# EAGLE design module-mcu (EAGLE 7.4.0)
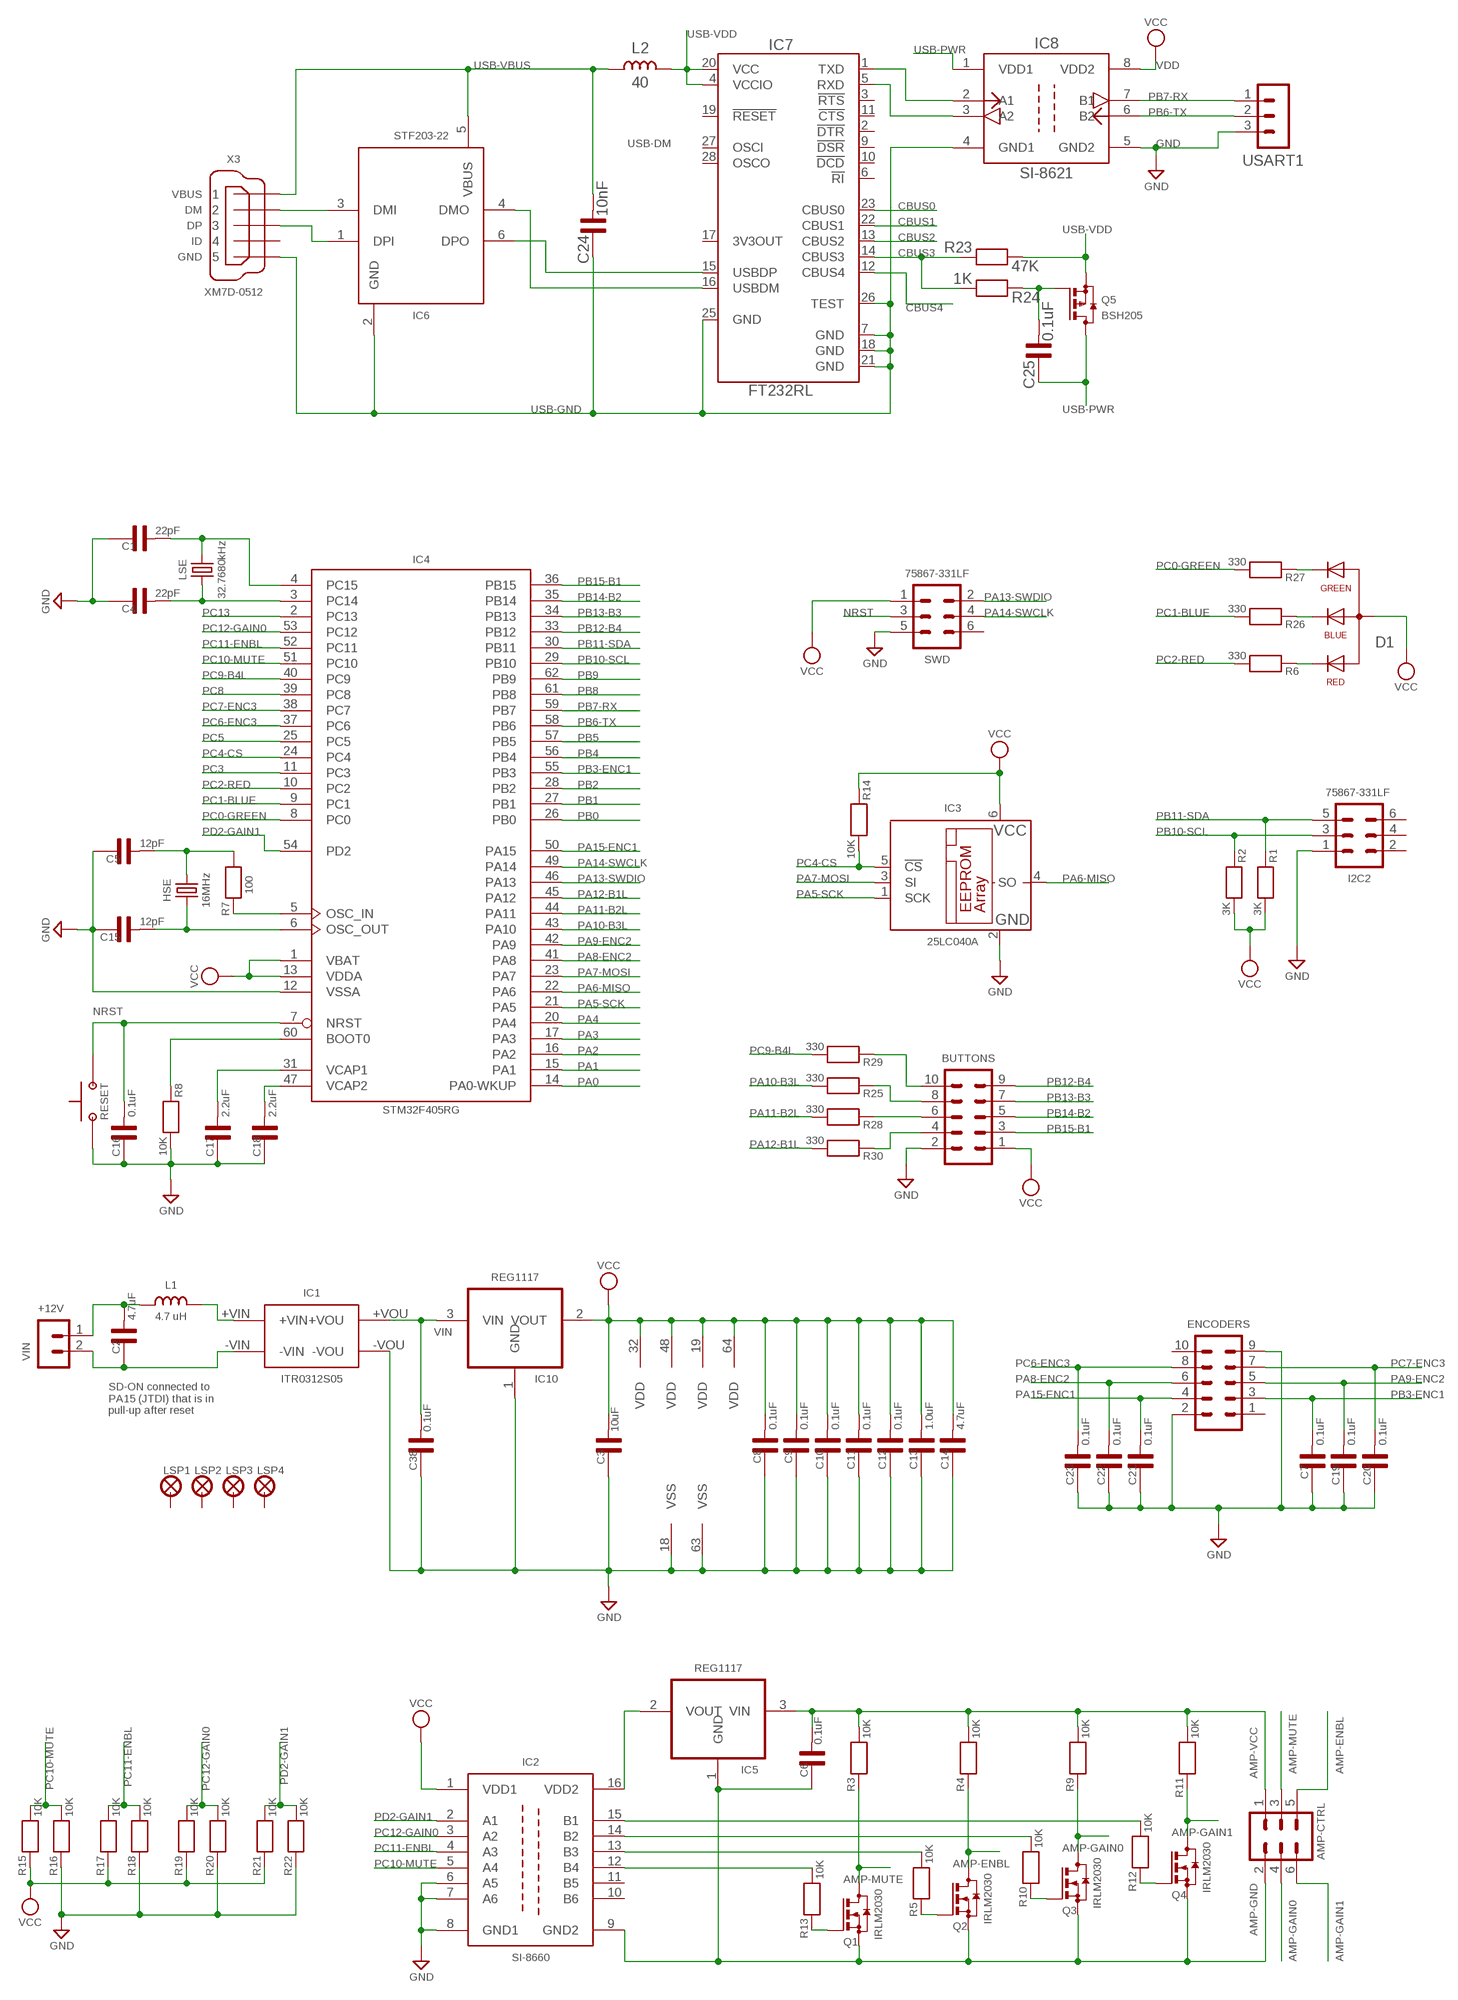
[diagram p0: schematic, sheet 1]

## Parts
AMP-CTRL  MA03-2PL  [MA03-2]
BUTTONS  MA05-2  [MA05-2]
C1  22pF  C-US0805  [C0805]
C2  4.7uF  C-US1206  [C1206]
C3  10uF  C-US0805  [C0805]
C4  22pF  C-US0805  [C0805]
C5  12pF  C-US0805  [C0805]
C6  0.1uF  C-US0805  [C0805]
C7  0.1uF  C-US0805  [C0805]
C8  0.1uF  C-US0805  [C0805]
C9  0.1uF  C-US0805  [C0805]
C10  0.1uF  C-US0805  [C0805]
C11  0.1uF  C-US0805  [C0805]
C12  0.1uF  C-US0805  [C0805]
C13  1.0uF  C-US0805  [C0805]
C14  4.7uF  C-US0805  [C0805]
C15  12pF  C-US0805  [C0805]
C16  0.1uF  C-US0805  [C0805]
C17  2.2uF  C-US0805  [C0805]
C18  2.2uF  C-US0805  [C0805]
C19  0.1uF  C-US0805  [C0805]
C20  0.1uF  C-US0805  [C0805]
C21  0.1uF  C-US0805  [C0805]
C22  0.1uF  C-US0805  [C0805]
C23  0.1uF  C-US0805  [C0805]
C24  10nF  C-US0805  [C0805]
C25  0.1uF  C-US0805  [C0805]
C38  0.1uF  C-US0805  [C0805]
D1  RGB-LED3X1MM  [RGB-LED-SMD-3X1]
ENCODERS  MA05-2  [MA05-2]
HSE  16MHz  Q-HSEHC-46X  [Q-HC-46X]
I2C2  75867-331LF  MA03-2PL  [MA03-2]
IC1  ITR0312S05  [ITR0312S05]
IC2  SI-8660  [SO16]
IC3  25LC040A  [SOT23-6]
IC4  STM32F405RG  STM32F405RGT  [LQFP64]
IC5  REG1117  [SOT223]
IC6  STF203-22  [SC70-6]
IC7  FT232RL  [SSOP28]
IC8  SI-8621  [SOIC-8]
IC10  REG1117  [SOT223]
L1  4.7 uH  L-USL0805  [L0805]
L2  40  L-USL0805  [L0805]
LSE  32.7680kHz  Q-LSECM7V-T1A  [Q-CM7V-T1A]
LSP1  LSP27  [LSP27]
LSP2  LSP27  [LSP27]
LSP3  LSP27  [LSP27]
LSP4  LSP27  [LSP27]
Q1  IRLM2030  BSS123  [SOT23]
Q2  IRLM2030  BSS123  [SOT23]
Q3  IRLM2030  BSS123  [SOT23]
Q4  IRLM2030  BSS123  [SOT23]
Q5  BSH205  BSH205G2R  [SOT23]
R1  3K  R-US0805  [R0805]
R2  3K  R-US0805  [R0805]
R3  10K  R-US0805  [R0805]
R4  10K  R-US0805  [R0805]
R5  10K  R-US0805  [R0805]
R6  330  R-US0805  [R0805]
R7  100  R-US0805  [R0805]
R8  10K  R-US0805  [R0805]
R9  10K  R-US0805  [R0805]
R10  10K  R-US0805  [R0805]
R11  10K  R-US0805  [R0805]
R12  10K  R-US0805  [R0805]
R13  10K  R-US0805  [R0805]
R14  10K  R-US0805  [R0805]
R15  10K  R-US0805  [R0805]
R16  10K  R-US0805  [R0805]
R17  10K  R-US0805  [R0805]
R18  10K  R-US0805  [R0805]
R19  10K  R-US0805  [R0805]
R20  10K  R-US0805  [R0805]
R21  10K  R-US0805  [R0805]
R22  10K  R-US0805  [R0805]
R23  47K  R-US0805  [R0805]
R24  1K  R-US0805  [R0805]
R25  330  R-US0805  [R0805]
R26  330  R-US0805  [R0805]
R27  330  R-US0805  [R0805]
R28  330  R-US0805  [R0805]
R29  330  R-US0805  [R0805]
R30  330  R-US0805  [R0805]
RESET  BUTTON-FSM14JRT  [BUTTON-FSM14JRT]
SWD  75867-331LF  MA03-2BLUE  [MA03-2-BLUE]
USART1  MA03-1PL  [MA03-1]
VIN  MA02-1GREEN  [MA02-1-GREEN]
X3  XM7D-0512  MINI-USB-5-DPI  [XM7D-0512]

## Nets
AMP-ENBL: AMP-CTRL.5 Q2.3(D) R4.1
AMP-GAIN0: AMP-CTRL.4 Q3.3(D) R9.1
AMP-GAIN1: AMP-CTRL.6 Q4.3(D) R11.1
AMP-GND: AMP-CTRL.2 C6.1 IC2.9(GND2) IC5.1(GND) Q1.2(S) Q2.2(S) Q3.2(S) Q4.2(S)
AMP-MUTE: AMP-CTRL.3 Q1.3(D) R3.1
AMP-VCC: AMP-CTRL.1 C6.2 IC5.3(VIN) R3.2 R4.2 R9.2 R11.2
BOOT: IC4.60(BOOT0) R8.1
CBUS0: IC7.23(CBUS0)
CBUS1: IC7.22(CBUS1)
CBUS2: IC7.13(CBUS2)
CBUS3: IC7.14(CBUS3) R23.1 R24.2
CBUS4: IC7.12(CBUS4)
GND: BUTTONS.2 C1.1 C3.1 C4.1 C5.1 C7.1 C8.1 C9.1 C10.1 C11.1 C12.1 C13.1 C14.1 C15.1 C16.1 C17.1 C18.1 C19.1 C20.1 C21.1 C22.1 C23.1 C38.1 ENCODERS.2 ENCODERS.9 I2C2.1 IC1.-VOU IC2.6(A5) IC2.7(A6) IC2.8(GND1) IC3.2(GND) IC4.12(VSSA) IC4.18(VSS) IC4.63(VSS) IC8.5(GND2) IC10.1(GND) R8.2 R16.1 R18.1 R20.1 R22.1 RESET.P$1 SWD.5 USART1.3
N$4: C2.1 IC1.-VIN VIN.2
N$5: D1.P$1(AR) R6.1
N$6: IC4.5(OSC_IN) R7.1
N$10: IC1.+VIN L1.2
N$11: C2.2 L1.1 VIN.1
N$13: Q2.1(G) R5.1
N$17: Q1.1(G) R13.1
N$22: IC2.12(B4) R13.2
N$24: IC2.13(B3) R5.2
N$26: Q3.1(G) R10.1
N$27: IC2.14(B2) R10.2
N$29: Q4.1(G) R12.1
N$36: IC2.15(B1) R12.2
N$37: IC2.16(VDD2) IC5.2(VOUT)
N$38: IC6.1(DPI) X3.3
N$40: D1.P$4(AB) R26.1
N$42: IC6.3(DMI) X3.2
N$43: IC7.1(TXD) IC8.2(A1)
N$44: IC7.5(RXD) IC8.3(A2)
N$46: C25.2 Q5.1(G) R24.1
N$47: BUTTONS.4 R30.1
N$64: BUTTONS.6 R28.1
N$65: BUTTONS.8 R25.1
N$69: BUTTONS.10 R29.1
N$71: C5.2 HSE.1 R7.2
N$75: D1.P$3(AG) R27.1
N$78: C15.2 HSE.2 IC4.6(OSC_OUT)
NRST: C16.2 IC4.7(NRST) RESET.P$2 SWD.3
PA0: IC4.14(PA0-WKUP)
PA1: IC4.15(PA1)
PA2: IC4.16(PA2)
PA3: IC4.17(PA3)
PA4: IC4.20(PA4)
PA5-SCK: IC3.1(SCK) IC4.21(PA5)
PA6-MISO: IC3.4(SO) IC4.22(PA6)
PA7-MOSI: IC3.3(SI) IC4.23(PA7)
PA8-ENC2: C22.2 ENCODERS.6 IC4.41(PA8)
PA9-ENC2: C19.2 ENCODERS.5 IC4.42(PA9)
PA10-B3L: IC4.43(PA10) R25.2
PA11-B2L: IC4.44(PA11) R28.2
PA12-B1L: IC4.45(PA12) R30.2
PA13-SWDIO: IC4.46(PA13) SWD.2
PA14-SWCLK: IC4.49(PA14) SWD.4
PA15-ENC1: C21.2 ENCODERS.4 IC4.50(PA15)
PB0: IC4.26(PB0)
PB1: IC4.27(PB1)
PB2: IC4.28(PB2)
PB3-ENC1: C7.2 ENCODERS.3 IC4.55(PB3)
PB4: IC4.56(PB4)
PB5: IC4.57(PB5)
PB6-TX: IC4.58(PB6) IC8.6(B2) USART1.2
PB7-RX: IC4.59(PB7) IC8.7(B1) USART1.1
PB8: IC4.61(PB8)
PB9: IC4.62(PB9)
PB10-SCL: I2C2.3 IC4.29(PB10) R2.1
PB11-SDA: I2C2.5 IC4.30(PB11) R1.1
PB12-B4: BUTTONS.9 IC4.33(PB12)
PB13-B3: BUTTONS.7 IC4.34(PB13)
PB14-B2: BUTTONS.5 IC4.35(PB14)
PB15-B1: BUTTONS.3 IC4.36(PB15)
PC0-GREEN: IC4.8(PC0) R27.2
PC1-BLUE: IC4.9(PC1) R26.2
PC2-RED: IC4.10(PC2) R6.2
PC3: IC4.11(PC3)
PC4-CS: IC3.5(!CS) IC4.24(PC4) R14.2
PC5: IC4.25(PC5)
PC6-ENC3: C23.2 ENCODERS.8 IC4.37(PC6)
PC7-ENC3: C20.2 ENCODERS.7 IC4.38(PC7)
PC8: IC4.39(PC8)
PC9-B4L: IC4.40(PC9) R29.2
PC10-MUTE: IC2.5(A4) IC4.51(PC10) R15.2 R16.2
PC11-ENBL: IC2.4(A3) IC4.52(PC11) R17.2 R18.2
PC12-GAIN0: IC2.3(A2) IC4.53(PC12) R19.2 R20.2
PC13: IC4.2(PC13)
PD2-GAIN1: IC2.2(A1) IC4.54(PD2) R21.2 R22.2
Q2M: C4.2 IC4.3(PC14) LSE.1
Q2P: C1.2 IC4.4(PC15) LSE.2
USB-DM: IC6.4(DMO) IC7.16(USBDM)
USB-DP: IC6.6(DPO) IC7.15(USBDP)
USB-GND: C24.1 IC6.2(GND) IC7.7(GND) IC7.18(GND) IC7.21(GND) IC7.25(GND) IC7.26(TEST) IC8.4(GND1) X3.5
USB-PWR: C25.1 IC8.1(VDD1) Q5.3(D)
USB-VBUS: C24.2 IC6.5(VBUS) L2.1 X3.1
USB-VDD: IC7.4(VCCIO) IC7.20(VCC) L2.2 Q5.2(S) R23.2
VCAP3: C18.2 IC4.47(VCAP2)
VCAP4: C17.2 IC4.31(VCAP1)
VDD: BUTTONS.1 C3.2 C8.2 C9.2 C10.2 C11.2 C12.2 C13.2 C14.2 D1.P$2(C) IC2.1(VDD1) IC3.6(VCC) IC4.1(VBAT) IC4.13(VDDA) IC4.19(VDD) IC4.32(VDD) IC4.48(VDD) IC4.64(VDD) IC8.8(VDD2) IC10.2(VOUT) R1.2 R2.2 R14.1 R15.1 R17.1 R19.1 R21.1 SWD.1 ; supply symbol labelled VCC
VIN: C38.2 IC1.+VOU IC10.3(VIN)
Unconnected: ENCODERS.1 ENCODERS.10 I2C2.2 I2C2.4 I2C2.6 IC2.10(B6) IC2.11(B5) IC7.2(!DTR) IC7.3(!RTS) IC7.6(!RI) IC7.9(!DSR) IC7.10(!DCD) IC7.11(!CTS) IC7.17(3V3OUT) IC7.19(!RESET) IC7.27(OSCI) IC7.28(OSCO) LSP1.MP LSP2.MP LSP3.MP LSP4.MP SWD.6 X3.4 X3.M1(S1) X3.M2(S2) X3.M3(S3) X3.M4(S4)

## Notes on the sheet
- SD-ON connected to 
  PA15 (JTDI) that is in 
  pull-up after reset

## Library data of the parts
AMP-CTRL I2C2 SWD = MyComponents:MA03-2: Headers & Wire Housing, 2 Row, 6 Position
BUTTONS ENCODERS = MyComponents:MA05-2: Headers & Wire Housing, 2 Row, 10 Position
C1 C3-C25 C38 = MyComponents:C-US: SMD Multilayer Ceramic Capacitor; MOUSER: 80-C0805C104J5RAUTO
C2 = MyComponents:C-US: SMD Multilayer Ceramic Capacitor
D1 = MyComponents:RGB-LED: T-1 3/4 (5mm) full color LED lamp; MOUSER: 604-APFA3010LSEEZGKQ
HSE = MyComponents:Q-HSE: HSE SMD Crystal; MOUSER: 520-160-20-46X
IC1 = MyComponents:ITR0312S05: ITR03 Series DC-DC Converter; MOUSER: 490-ITR0312S05
IC2 = MyComponents:SI-8660: Ultra-low-power digital isolator (6 channels)
IC3 = MyComponents:25LC040A: 4K SPI Bus Serial EEPROM; MOUSER: 579-25LC040AT-E/OT
IC4 = stm32:STM32F405R*T: ARM 32-bit Cortex™-M3 CPU 168 MHz maximum frequency 1024 Kbytes of Flash memory 192 kbytes of SRAM 51 GPIOs 1.8 to 3.6 V application supply; MOUSER: 511-STM32F405RGT6
IC5 IC10 = MyComponents:REG1117: 800mA and 1A Low Dropout (LDO) Positive Regulator 1.8V, 2.5V, 2.85V, 3.3V, 5V, and Adj; MOUSER: 511-LD1117S33
IC6 = MyComponents:STF203: USB EMI filtering and ESD protection; MOUSER: 947-STF203-22.TCT
IC7 = ftdichip:FT232R: Source: http://www.ftdichip.com/Documents/DataSheets/DS_FT232R_v104.pdf; MOUSER: 895-FT232RL
IC8 = MyComponents:SI-8621: Two channel ultra-low-power digital isolator; MOUSER: 634-SI8621AB-B-IS
L1 L2 = MyComponents:L-US: SMD Ferrite Bead; MOUSER: 963-CKP2012N1R0M-T
LSE = MyComponents:Q-LSE: 32.768 kHz SMD Crystal; MOUSER: 428-201562-MG01
LSP1-LSP4 = MyComponents:LSP27: Solder Pad, drill 2.75 mm
Q1-Q4 = transistor-small-signal:BSS123: N-CHANNEL MOS FET
Q5 = MyComponents:BSH205G2R: P-channel enhancement mode MOSFET (-2.3A); MOUSER: 771-BSH205G2R
R1-R30 = MyComponents:R-US: SMD Resistor; MOUSER: 660-RK73H2ATTDD1R00F
RESET = MyComponents:BUTTON-FSM14JRT: TE Connectivity / Alcoswitch Round Switch; MOUSER: 506-1571010-1
USART1 = MyComponents:MA03-1: Headers & Wire Housing, 1 Row, 3 Position
VIN = MyComponents:MA02-1: Headers & Wire Housing, 1 Row, 3 Position
X3 = MyComponents:MINI-USB-5-DPI: Mini USB Type B Connector; MOUSER: 653-XM7D-0512

## Board
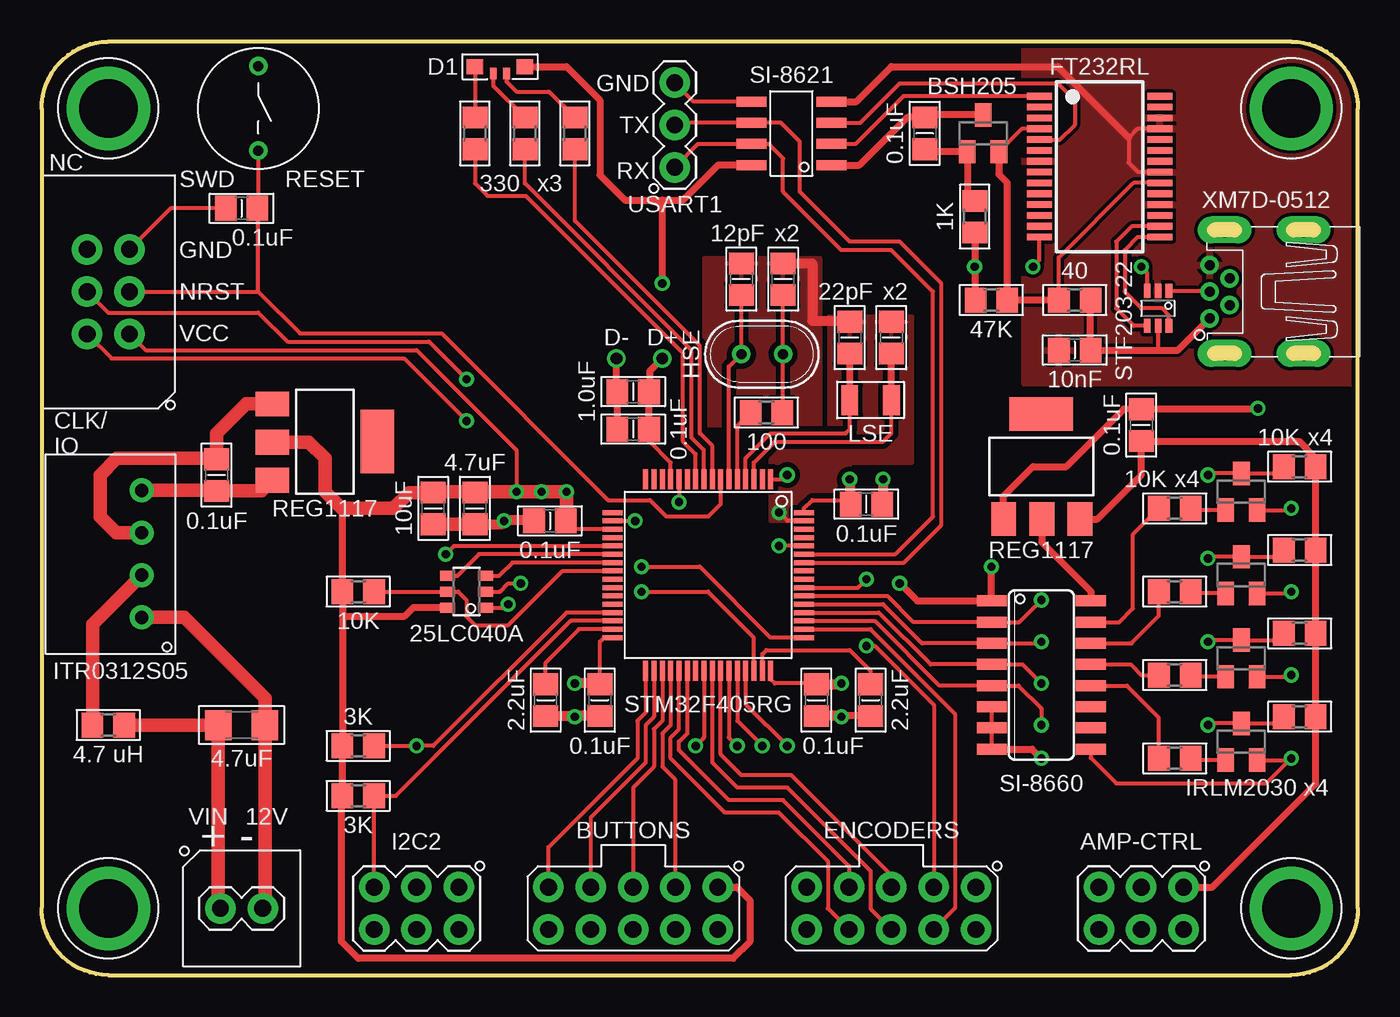
[diagram p1: board, top side]
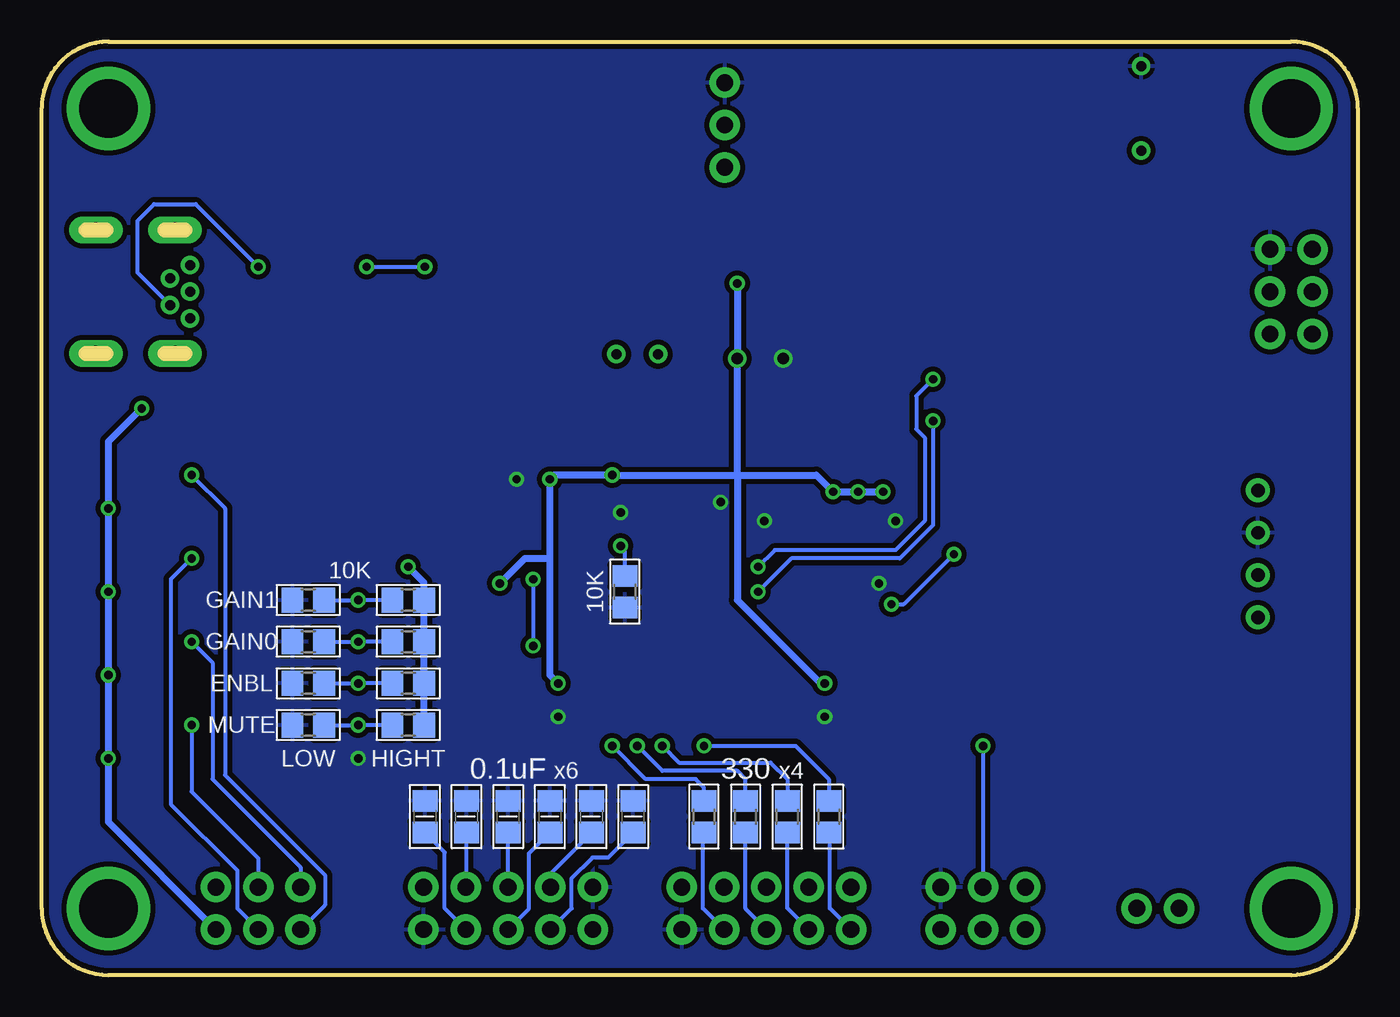
[diagram p2: board, bottom side, seen from below]

Size 79 x 56 mm. Coordinates in mm from the lower left corner, seen from the top.
Outline: 79,4 79,52 arc90 75,56 4,56 arc90 0,52 0,4 arc90 4,0 75,0 arc90 79,4
Copper layers (1*16): Top 0.035mm / dielectric 1.5mm / Bottom 0.035mm
Design rules "eagle *": minimum track width 10mil, minimum drill 19mil, track to track 8mil, track to pad 8mil, pad to pad 7mil, via to via 12mil, smd to smd 7mil, copper to edge 10mil, drill to drill 30mil, minimum pad ring 10mil, minimum via ring 8mil, stop-mask expansion 4mil, vias tented up to drill 0mil, thermal gap 10mil

### Footprints (pad centres in the part's own frame; a part is rotated, then mirrored left to right if it is on the bottom)
MA03-2 = drill 1.016: 1 -2.54,-1.27; 2 -2.54,1.27; 3 0,-1.27; 4 0,1.27; 5 2.54,-1.27; 6 2.54,1.27
MA05-2 = drill 1.016: 1 -5.08,-1.27; 2 -5.08,1.27; 3 -2.54,-1.27; 4 -2.54,1.27; 5 0,-1.27; 6 0,1.27; 7 2.54,-1.27; 8 2.54,1.27; 9 5.08,-1.27; 10 5.08,1.27
C0805 = smd 1.3 x 1.5: 1 -0.95,0; 2 0.95,0
C1206 = smd 1.6 x 1.8: 1 -1.4,0; 2 1.4,0
RGB-LED-SMD-3X1 = smd 1 x 0.9: P$1 1.5,0; P$2 -1.5,0 | smd 0.4 x 0.68: P$3 -0.4,0.4; P$4 0.4,0.4
Q-HC-46X = drill 0.61: 1 -1.25,0; 2 1.25,0
ITR0312S05 = drill 0.8: +VIN 0,0; +VOU 5.08,0; -VIN -2.54,0; -VOU 2.54,0
SO16 = smd 0.66 x 1.8: 1 -4.445,-2.973; 2 -3.175,-2.973; 3 -1.905,-2.973; 4 -0.635,-2.973; 5 0.635,-2.973; 6 1.905,-2.973; 7 3.175,-2.973; 8 4.445,-2.973; 9 4.445,2.973; 10 3.175,2.973; 11 1.905,2.973; 12 0.635,2.973; 13 -0.635,2.973; 14 -1.905,2.973; 15 -3.175,2.973; 16 -4.445,2.973
SOT23-6 = smd 0.6 x 0.9: 1 -0.95,-1.15; 2 0,-1.15; 3 0.95,-1.15; 4 0.95,1.15; 5 0,1.15; 6 -0.95,1.15
LQFP64 = smd 0.3 x 1.2: 1 -3.75,-5.75; 2 -3.25,-5.75; 3 -2.75,-5.75; 4 -2.25,-5.75; 5 -1.75,-5.75; 6 -1.25,-5.75; 7 -0.75,-5.75; 8 -0.25,-5.75; 9 0.25,-5.75; 10 0.75,-5.75; 11 1.25,-5.75; 12 1.75,-5.75; 13 2.25,-5.75; 14 2.75,-5.75; 15 3.25,-5.75; 16 3.75,-5.75; 33 3.75,5.75; 34 3.25,5.75; 35 2.75,5.75; 36 2.25,5.75; 37 1.75,5.75; 38 1.25,5.75; 39 0.75,5.75; 40 0.25,5.75; 41 -0.25,5.75; 42 -0.75,5.75; 43 -1.25,5.75; 44 -1.75,5.75; 45 -2.25,5.75; 46 -2.75,5.75; 47 -3.25,5.75; 48 -3.75,5.75 | smd 1.2 x 0.3: 17 5.75,-3.75; 18 5.75,-3.25; 19 5.75,-2.75; 20 5.75,-2.25; 21 5.75,-1.75; 22 5.75,-1.25; 23 5.75,-0.75; 24 5.75,-0.25; 25 5.75,0.25; 26 5.75,0.75; 27 5.75,1.25; 28 5.75,1.75; 29 5.75,2.25; 30 5.75,2.75; 31 5.75,3.25; 32 5.75,3.75; 49 -5.75,3.75; 50 -5.75,3.25; 51 -5.75,2.75; 52 -5.75,2.25; 53 -5.75,1.75; 54 -5.75,1.25; 55 -5.75,0.75; 56 -5.75,0.25; 57 -5.75,-0.25; 58 -5.75,-0.75; 59 -5.75,-1.25; 60 -5.75,-1.75; 61 -5.75,-2.25; 62 -5.75,-2.75; 63 -5.75,-3.25; 64 -5.75,-3.75
SOT223 = smd 1.499 x 2.007: 1 -2.261,-3.15; 2 0.025,-3.15; 3 2.311,-3.15 | smd 3.81 x 2.007: 4 0,3.15
SC70-6 = smd 0.4 x 0.85: 1 -0.65,-1.05; 2 0,-1.05; 3 0.65,-1.05; 4 0.65,1.05; 5 0,1.05; 6 -0.65,1.05
SSOP28 = smd 0.4 x 1.5: 1 -4.225,-3.625; 2 -3.575,-3.625; 3 -2.925,-3.625; 4 -2.275,-3.625; 5 -1.625,-3.625; 6 -0.975,-3.625; 7 -0.325,-3.625; 8 0.325,-3.625; 9 0.975,-3.625; 10 1.625,-3.625; 11 2.275,-3.625; 12 2.925,-3.625; 13 3.575,-3.625; 14 4.225,-3.625; 15 4.225,3.625; 16 3.575,3.625; 17 2.925,3.625; 18 2.275,3.625; 19 1.625,3.625; 20 0.975,3.625; 21 0.325,3.625; 22 -0.325,3.625; 23 -0.975,3.625; 24 -1.625,3.625; 25 -2.275,3.625; 26 -2.925,3.625; 27 -3.575,3.625; 28 -4.225,3.625
SOIC-8 = smd 0.6 x 1.8: 1 -1.905,-2.4; 2 -0.635,-2.4; 3 0.635,-2.4; 4 1.905,-2.4; 5 1.905,2.4; 6 0.635,2.4; 7 -0.635,2.4; 8 -1.905,2.4
L0805 = smd 1.3 x 1.5: 1 -0.95,0; 2 0.95,0
Q-CM7V-T1A = smd 1 x 1.8: 1 -1.25,0; 2 1.25,0
LSP27 = drill 3.5 pad 5: MP 0,0
SOT23 = smd 1 x 1.4: 1 -0.95,-1.1; 2 0.95,-1.1; 3 0,1.1
R0805 = smd 1.3 x 1.5: 1 -0.95,0; 2 0.95,0
BUTTON-FSM14JRT = drill 0.6: P$1 -2.54,0; P$2 2.54,0
MA03-2-BLUE = drill 1.016: 1 -2.54,-1.27; 2 -2.54,1.27; 3 0,-1.27; 4 0,1.27; 5 2.54,-1.27; 6 2.54,1.27
MA03-1 = drill 1.016: 1 -2.54,0; 2 0,0; 3 2.54,0
MA02-1-GREEN = drill 1.016: 1 -1.27,0; 2 1.27,0
XM7D-0512 = drill 0.6 pad 1.016: 1 1.6,-0.9; 2 0.8,0.3; 3 0,-0.9; 4 -0.8,0.3; 5 -1.6,-0.9 | drill 0.9 pad 1.422 long: M1 3.7,4.75; M2 -3.7,4.75; M3 -3.7,0; M4 3.7,0

### Placement (x,y rotation side)
AMP-CTRL  66,4 180 top
BUTTONS  35.5,4 180 top
C1  48.5,38.25 270 top
C2  12,15 180 top
C3  23.5,28 90 top
C4  51,38.25 270 top
C5  44.5,41.75 270 top
C6  66,33 270 top
C7  53.5,9.5 270 bottom
C8  46.5,16.5 90 top
C9  33.5,16.5 90 top
C10  35.5,32.75 0 top
C11  30.5,27.25 0 top
C12  49.5,28.25 180 top
C13  35.5,35 0 top
C14  26,28 90 top
C15  42,41.75 270 top
C16  12,46 0 top
C17  30.25,16.5 90 top
C18  49.75,16.5 90 top
C19  51,9.5 270 bottom
C20  46,9.5 270 bottom
C21  56,9.5 270 bottom
C22  48.5,9.5 270 bottom
C23  43.5,9.5 270 bottom
C24  62,37.5 0 top
C25  53,50.5 270 top
C38  10.5,30 270 top
D1  27.5,54.5 180 top
ENCODERS  51,4 180 top
HSE  43.25,37.25 180 top
I2C2  22.5,4 180 top
IC1  6,24 90 top
IC2  60,18 270 top
IC3  25.5,23 90 top
IC4  40,24 180 top
IC5  60,30.5 0 top
IC6  67,40 180 top
IC7  63.5,48.5 270 top
IC8  45,50.5 90 top
IC10  17,32 270 top
L1  4,15 180 top
L2  62,40.5 180 top
LSE  49.75,34.5 180 top
LSP1  75,4 90 top
LSP2  75,52 90 top
LSP3  4,4 90 top
LSP4  4,52 90 top
Q1  72,14 0 top
Q2  72,19 0 top
Q3  72,24 0 top
Q4  72,29 0 top
Q5  56.5,50.5 0 top
R1  19,10.75 180 top
R2  19,13.75 180 top
R3  75.5,15.5 0 top
R4  75.5,20.5 0 top
R5  68,18 180 top
R6  26,50.5 270 top
R7  43.5,33.75 0 top
R8  44,23 270 bottom
R9  75.5,25.5 0 top
R10  68,23 180 top
R11  75.5,30.5 0 top
R12  68,28 180 top
R13  68,13 180 top
R14  19,23 0 top
R15  57,15 180 bottom
R16  63,15 0 bottom
R17  57,17.5 180 bottom
R18  63,17.5 0 bottom
R19  57,20 180 bottom
R20  63,20 0 bottom
R21  57,22.5 180 bottom
R22  63,22.5 0 bottom
R23  57,40.5 0 top
R24  56,45.5 270 top
R25  34.25,9.5 90 bottom
R26  29,50.5 270 top
R27  32,50.5 270 top
R28  36.75,9.5 90 bottom
R29  31.75,9.5 90 bottom
R30  39.25,9.5 90 bottom
RESET  13,52 270 top
SWD  4,41 90 top
USART1  38,51 90 top
VIN  12,4 0 top
X3  71,41 270 top

### Tracks (layer width: path | path; a pad name or v marks a point on that pad's centre or on a via)
AMP-ENBL  (via drill 0.5)
  Top 0.254: v70,20 70.1,20.1 Q2.3 74.55,20.1 R4.1
  Bottom 0.254: v70,20 68.75,18.75 68.75,11.75 63.46,6.46 AMP-CTRL.5
AMP-GAIN0  (via drill 0.5)
  Top 0.254: v70,25 70.1,25.1 Q3.3 74.55,25.1 R9.1
  Bottom 0.254: v70,25 71.25,23.75 71.25,10.25 67.25,6.25 67.25,3.98 AMP-CTRL.4
AMP-GAIN1  (via drill 0.5)
  Top 0.254: v70,30 70.1,30.1 Q4.3 74.55,30.1 R11.1
  Bottom 0.254: v70,30 68,28 68,12 62,6 62,4.19 AMP-CTRL.6
AMP-GND  (via drill 0.5)
  Top 0.254: Q1.2 74.9,12.9 v75,13 73.5,11.5 64.5,11.5 62.97,13.03 IC2.9 | Q2.2 74.9,17.9 v75,18 | Q3.2 74.9,22.9 v75,23 | Q4.2 74.9,27.9 v75,28 | v73,34 72.95,33.95
  Top 0.406: 72.95,33.95 C6.1 64.95,33.95 61.5,30.5 59.5,30.5 57.74,28.74 IC5.1
  Bottom 0.406: AMP-CTRL.2 75,9.19 v75,13 v75,18 v75,23 v75,28 75,32 v73,34
AMP-MUTE  (via drill 0.5)
  Top 0.254: v70,15 70.1,15.1 Q1.3 74.55,15.1 R3.1
  Bottom 0.254: v70,15 70,11 66,7 AMP-CTRL.3
AMP-VCC
  Top 0.254: R11.2 76.45,31.05 | 66.05,32 C6.2
  Top 0.406: R11.2 R9.2 R4.2 R3.2 76.45,11.45 70.27,5.27 AMP-CTRL.1 | 76.45,31.05 75.5,32 66.05,32 | IC5.3 63.35,27.35 66,30 C6.2
BOOT  (via drill 0.5)
  Top 0.254: IC4.60 v44.25,25.75
  Bottom 0.254: R8.1 44,25.5 v44.25,25.75
CBUS3  (via drill 0.5)
  Top 0.254: IC7.14 59.88,42.88 v59.5,42.5
  Top 0.406: R23.1 56.05,42.45 v56,42.5 R24.2
  Bottom 0.254: v59.5,42.5 v56,42.5
GND  (via drill 0.5, 0.7)
  Top 0.254: IC4.18 v35.62,27.25 | IC4.12 v38.25,28.38 | IC4.63 44.75,27.25 v44.25,27.75 | C16.1 7.73,46 SWD.5 | IC3.2 27.5,23 28,23.5 v28.75,23.5 | IC2.6 IC2.7 IC2.8 | IC8.5 39.13,52.41 USART1.3
  Top 0.406: 48,15.55 v48,15.5 48.05,15.55 C18.1 | C10.1 C13.1 34.5,35.05 v34.5,37 | IC2.8 59.45,13.55 v60,13
  Top 0.61: 33.45,15.5 C9.1 32,15.55 | 48,15.55 C8.1 | 30.3,15.5 C17.1 32,15.55 | 32,15.55 v32,15.5 | C11.1 29.5,27.3 27.8,27.3 v27.75,27.25 arc-90 27.55,27.05 C14.1 | v50.5,29.75 50.5,28.3 C12.1 | C5.1 46.25,42.7 46.25,39.25 48.5,39.25 C1.1
  Top 0.813: 6.04,26.5 IC1.-VOU 4.46,26.54 3.5,27.5 3.5,30 4.5,31 10.45,31 C38.1 10.5,32.5 12.26,34.26 IC10.1 | C3.1 C14.1
  pour Bottom (isolate 0.305, rank 2): 0,56 79,56 79,0 0,0
  pour Top (isolate 0.305): 47.25,39.5 47.25,31.5 43.75,31.5 43.75,27.25 45.75,27.25 45.75,28.5 48.5,28.5 48.5,30.75 52.25,30.75 52.25,39.5
  pour Top (isolate 0.305): 39.75,43 39.75,33 46.75,33 46.75,43
N$4
  Top 0.813: VIN.2 13.4,4.13 C2.1 13.4,16.6 8.54,21.46 IC1.-VIN
N$5
  Top 0.254: D1.P$1 R6.1
N$6
  Top 0.254: IC4.5 41.75,32.95 R7.1
N$10
  Top 0.813: L1.2 3.05,21.05 IC1.+VIN
N$11
  Top 0.813: VIN.1 arc-90 10.6,4.13 C2.2 L1.1
N$13
  Top 0.254: Q2.1 69.05,17.9 R5.1
N$17
  Top 0.254: Q1.1 69.05,12.9 R13.1
N$22
  Top 0.254: IC2.12 65.14,17.36 67.05,15.45 R13.2
N$24
  Top 0.254: IC2.13 65.36,18.64 66,18 R5.2
N$26
  Top 0.254: Q3.1 69.05,22.9 R10.1
N$27
  Top 0.254: IC2.14 65.41,19.91 67.05,21.55 R10.2
N$29
  Top 0.254: Q4.1 69.05,27.9 R12.1
N$36
  Top 0.254: IC2.15 64.67,21.18 65.5,22 65.5,26.45 R12.2
N$37
  Top 0.406: IC5.2 60.02,25.98 62.97,23.03 IC2.16
N$38
  Top 0.254: IC6.1 70.05,41.05 X3.3
N$40
  Top 0.254: D1.P$4 27.1,53.35 R26.1
N$42  (via drill 0.5)
  Top 0.254: IC6.3 66.35,42.15 v66,42.5
  Bottom 0.254: X3.2 73.25,42.15 73.25,45.25 72.25,46.25 69.75,46.25 v66,42.5
N$43
  Top 0.254: IC8.2 48.87,49.87 51.73,52.73 IC7.1
N$44
  Top 0.254: IC8.3 49.13,51.13 51.5,53.5 61,53.5 62,52.5 62,51 61.12,50.12 IC7.5
N$46
  Top 0.406: R24.1 55.55,46.9 Q5.1 53.15,49.4 C25.2
N$47
  Bottom 0.254: BUTTONS.4 39.31,4 39.31,8.55 R30.1
N$64
  Bottom 0.254: BUTTONS.6 36.75,3.98 R28.1
N$65
  Bottom 0.254: BUTTONS.8 34.25,4.02 R25.1
N$69
  Bottom 0.254: BUTTONS.10 31.69,4 31.69,8.55 R29.1
N$71
  Top 0.254: C5.2 HSE.1 44.5,33.8 R7.2
N$75
  Top 0.254: D1.P$3 27.9,53.6 28.5,53 30.45,53 R27.1
N$78
  Top 0.254: C15.2 HSE.2 41.25,36.5 IC4.6
NRST
  Top 0.254: IC4.7 40.75,28.25 40,27.5 37.5,27.5 36.5,28.5 34,28.5 24,38.5 15.5,38.5 13,41 | SWD.3 13,41 | RESET.P$2 13,46.05 C16.2 13,45.95 13,41
PA5-SCK  (via drill 0.5)
  Top 0.254: v24.25,25.25 24.75,25.75 IC4.21 | IC3.1 27.8,22.05 v28,22.25
  Bottom 0.254: v24.25,25.25 27.25,22.25 v28,22.25
PA6-MISO
  Top 0.254: IC4.22 26.25,25.25 24.95,23.95 IC3.4
PA7-MOSI
  Top 0.254: IC4.23 28.25,24.75 27.45,23.95 IC3.3
PA8-ENC2
  Top 0.254: ENCODERS.6 49.75,3.98 49.75,6.25 44.75,11.25 41.75,11.25 40.25,12.75 IC4.41
  Bottom 0.254: ENCODERS.6 49.75,3.98 49.75,7.3 C22.2
PA9-ENC2
  Top 0.254: ENCODERS.5 51,6 45,12 42,12 40.75,13.25 IC4.42
  Bottom 0.254: ENCODERS.5 C19.2
PA10-B3L  (via drill 0.5)
  Top 0.254: IC4.43 41.25,14.25 v41.75,13.75
  Bottom 0.254: v41.75,13.75 40.75,12.75 35.25,12.75 34.25,11.75 R25.2
PA11-B2L  (via drill 0.5)
  Top 0.254: IC4.44 41.75,15.25 v43.25,13.75
  Bottom 0.254: R28.2 36.75,11.75 37.25,12.25 41.75,12.25 v43.25,13.75
PA12-B1L  (via drill 0.5)
  Top 0.254: IC4.45 42.25,16.25 v44.75,13.75
  Bottom 0.254: R30.2 39.25,11.25 39.75,11.75 42.75,11.75 v44.75,13.75
PA13-SWDIO  (via drill 0.5)
  Top 0.254: v36,23 40,23 42.75,20.25 IC4.46 | SWD.2 4.19,37 21.75,37 v25.5,33.25
  Bottom 0.254: v36,23 34,25 27.5,25 25.5,27 v25.5,33.25
PA14-SWCLK  (via drill 0.5)
  Top 0.254: v36,24.5 39.5,24.5 43.75,20.25 IC4.49 | SWD.4 3.98,39.75 13,39.75 14.75,38 23.25,38 v25.5,35.75
  Bottom 0.254: v36,24.5 35,25.5 27.75,25.5 26,27.25 26,32.25 26.5,32.75 26.5,34.75 v25.5,35.75
PA15-ENC1
  Top 0.254: IC4.50 49.75,20.75 54.81,15.69 54.81,4 ENCODERS.4
  Bottom 0.254: ENCODERS.4 54.81,4 54.81,7.36 C21.2
PB3-ENC1  (via drill 0.5)
  Top 0.254: IC4.55 49,23.25 v49.5,23.75 | v49.5,19.75 50,19.75 53.54,16.21 ENCODERS.3
  Bottom 0.254: v49.5,23.75 v49.5,19.75 | C7.2 53.54,8.51 ENCODERS.3
PB6-TX
  Top 0.254: USART1.2 38.13,51.13 IC8.6 44.37,51.13 45.5,50 45.5,47 48.5,44 51.5,44 54,41.5 54,27 51.75,24.75 IC4.58
PB7-RX
  Top 0.254: USART1.1 39.41,49.87 IC8.7 43.63,49.87 44.5,49 44.5,47 48,43.5 51,43.5 53.5,41 53.5,27.5 51.25,25.25 IC4.59
PB10-SCL  (via drill 0.5)
  Top 0.254: IC4.29 31.5,21.75 23.5,13.75 v22.5,13.75 R2.1
  Bottom 0.254: v22.5,13.75 I2C2.3
PB11-SDA
  Top 0.254: IC4.30 31.75,21.25 21.25,10.75 R1.1 I2C2.5
PB12-B4
  Top 0.254: IC4.33 36.25,15.75 35.75,15.25 35.75,13 30.42,7.67 BUTTONS.9
PB13-B3
  Top 0.254: IC4.34 36.75,15.5 36.25,15 36.25,12.75 32.96,9.46 BUTTONS.7
PB14-B2
  Top 0.254: IC4.35 37.25,15.25 36.75,14.75 36.75,12.5 35.5,11.25 BUTTONS.5
PB15-B1
  Top 0.254: IC4.36 37.75,15 37.25,14.5 37.25,12.5 38,11.75 38,5.31 BUTTONS.3
PC0-GREEN
  Top 0.254: IC4.8 40.25,31.75 39.5,32.5 39.5,37.75 32,45.25 R27.2
PC1-BLUE
  Top 0.254: IC4.9 39.75,31.5 39,32.25 39,37.5 29,47.5 R26.2
PC2-RED
  Top 0.254: IC4.10 39.25,31.25 38.5,32 38.5,37.3 29.05,46.75 26.75,46.75 26,47.5 R6.2
PC4-CS
  Top 0.254: R14.2 IC3.5 25,23 25.5,22.5 25.5,21.5 26,21 28,21 31.25,24.25 IC4.24
PC6-ENC3
  Top 0.254: ENCODERS.8 47.19,4 47.19,6.81 44.25,9.75 41,9.75 37.75,13 37.75,14.25 38.25,14.75 IC4.37
  Bottom 0.254: ENCODERS.8 47.19,4 47.19,5.81 45.95,7.05 45,7.05 C23.2
PC7-ENC3
  Top 0.254: ENCODERS.7 48.46,6.54 44.5,10.5 41.25,10.5 38.25,13.5 38.25,14 38.75,14.5 IC4.38
  Bottom 0.254: C20.2 48.46,6.09 ENCODERS.7
PC9-B4L  (via drill 0.5)
  Top 0.254: IC4.40 39.75,14.25 v39.25,13.75
  Bottom 0.254: v39.25,13.75 33.75,13.75 31.75,11.75 R29.2
PC10-MUTE  (via drill 0.5)
  Top 0.254: v60,15 60,16 58.63,17.36 IC2.5 53.88,17.36 50,21.25 IC4.51
  Bottom 0.254: R15.2 v60,15 R16.2
PC11-ENBL  (via drill 0.5)
  Top 0.254: v60,17.5 58.87,18.64 IC2.4 53.37,18.64 50.25,21.75 IC4.52
  Bottom 0.254: R18.2 v60,17.5 R17.2
PC12-GAIN0  (via drill 0.5)
  Top 0.254: IC4.53 50.5,22.25 52.84,19.91 IC2.3 59.91,19.91 v60,20
  Bottom 0.254: R20.2 v60,20 R19.2
PD2-GAIN1  (via drill 0.5)
  Top 0.254: IC4.54 50.75,22.75 52.33,21.18 IC2.2 58.67,21.18 v60,22.5
  Bottom 0.254: R21.2 v60,22.5 R22.2
Q2M
  Top 0.254: IC4.3 42.75,30.75 44,32 50.5,32 51,32.5 LSE.1 51.25,34.5
  Top 0.406: LSE.1 C4.2
Q2P
  Top 0.254: IC4.4 42.25,31 43.75,32.5 48.25,32.5 48.5,32.75 LSE.2
  Top 0.406: LSE.2 C1.2
USB-DM
  Top 0.254: IC6.4 65.55,38.95 64.5,40 64.5,44 65.42,44.92 IC7.16
USB-DP
  Top 0.254: IC6.6 67.65,39.6 67.25,40 66,40 65,41 65,43.5 65.78,44.27 IC7.15
USB-GND
  Top 0.254: IC7.21 65.83,48.17 65.25,48.75 65.25,50.25 65.78,50.77 IC7.25
  Top 0.406: IC8.4 48.91,52.41 51,54.5 61,54.5 65.25,50.25
  pour Top: 79,35.5 59,35.5 59,56 79,56
USB-PWR
  Top 0.406: Q5.3 53.15,51.6 C25.1 51.95,51.45 49.09,48.59 IC8.1
USB-VBUS
  Top 0.254: IC6.5 67,37.5
  Top 0.406: X3.1 68.2,37.5 67,37.5 C24.2 L2.1
USB-VDD
  Top 0.254: IC7.4 58.83,50.77 Q5.2 | IC7.20 65.53,47.52 61.05,43.05 L2.2
  Top 0.406: Q5.2 57.45,48.05 57.95,47.55 R23.2 L2.2
VCAP3
  Top 0.254: IC4.47 43.25,19.25 43.5,19.5 48.5,19.5 49.75,18.25 C18.2
VCAP4
  Top 0.254: C17.2 30.25,18.75 32.25,20.75 IC4.31
VDD  (via drill 0.5, 0.7)
  Top 0.254: C9.2 33.5,20 33.75,20.25 IC4.32 | C8.2 46.45,17.5 44,17.5 43.75,17.75 IC4.48 | IC4.64 45.75,28 46.25,28.5 48.3,28.5 C12.2 | IC4.1 44.5,29.75 v44.75,30 | IC4.19 31.95,26.75 C11.2 | v28.5,29 28.5,31.5 22.5,37.5 6.23,37.5 SWD.1 | IC4.13 37.75,30.75 36.45,32.05 C10.2 | 19.05,27.95 19,28 | 18.05,27.95 18,28 | 18,10.7 R1.2
  Top 0.406: R1.2 R2.2 18.05,21.5 | IC3.6 22.3,22.05 21.75,21.5 18.05,21.5 | 18.05,21.5 R14.1 18.05,27.95 | 36.45,32.3 C10.2 C13.2 36.5,35.05 36.5,36.25 v37.25,37 | IC8.8 40.59,48.59 38.5,46.5 37.25,46.5 | v51.5,23.5 52.55,22.45 IC2.1 57,22.47 v57,24.5 | BUTTONS.1 41.73,5.27 42.5,4.5 42.5,2 41.5,1 19,1 18,2 18,10.7 | D1.P$2 31.5,54.5 33.5,52.5 33.5,48 35,46.5 37.25,46.5 | v37.25,41.5 37.25,46.5
  Top 0.61: C9.2 33.45,17.5 v32,17.5 | C8.2 47.95,17.45 v48,17.5 | v48.5,29.75 48.5,28.3 C12.2 | 31.5,27.3 C11.2
  Top 0.813: C11.2 arc90 31.5,27.3 v31.5,29 v28.5,29 25.55,29 | 25.55,29 arc90 C14.2 | 25.55,29 23.55,29 C3.2 22.05,28.95 21.1,28 19,28 18,28 17,29 17,31 16.02,31.98 IC10.2
  Bottom 0.406: 32.05,17.55 v32,17.5 32.25,17.5 37.25,22.5 37.25,30 | 37.25,30 v44.75,30 48.25,30 v48.5,29.75 48.5,25 | v28.5,29 v30,29 v31.5,29 32.5,30 37.25,30 | R15.1 R17.1 R19.1 R21.1 56.05,23.55 v57,24.5 | v48,17.5 48.5,18 48.5,25 | v51.5,23.5 50,25 48.5,25 | v37.25,41.5 v37.25,37 37.25,30
VIN
  Top 0.813: IC1.+VOU 10.47,29.08 C38.2 13.21,29.05 IC10.3

### Text on the board
tPlace: + -
tNames: GND | TX | NC | SWD | x3 | RX | GND | x2 | NRST | x2 | VCC | D- | D+ | CLK/ / IO | x4 | x4 | x4 | 12V
bNames: GAIN1 | GAIN0 | ENBL | HIGHT | LOW | MUTE | x4 | x6